# EAGLE design BluetoothB1 (EAGLE 7.7.0)
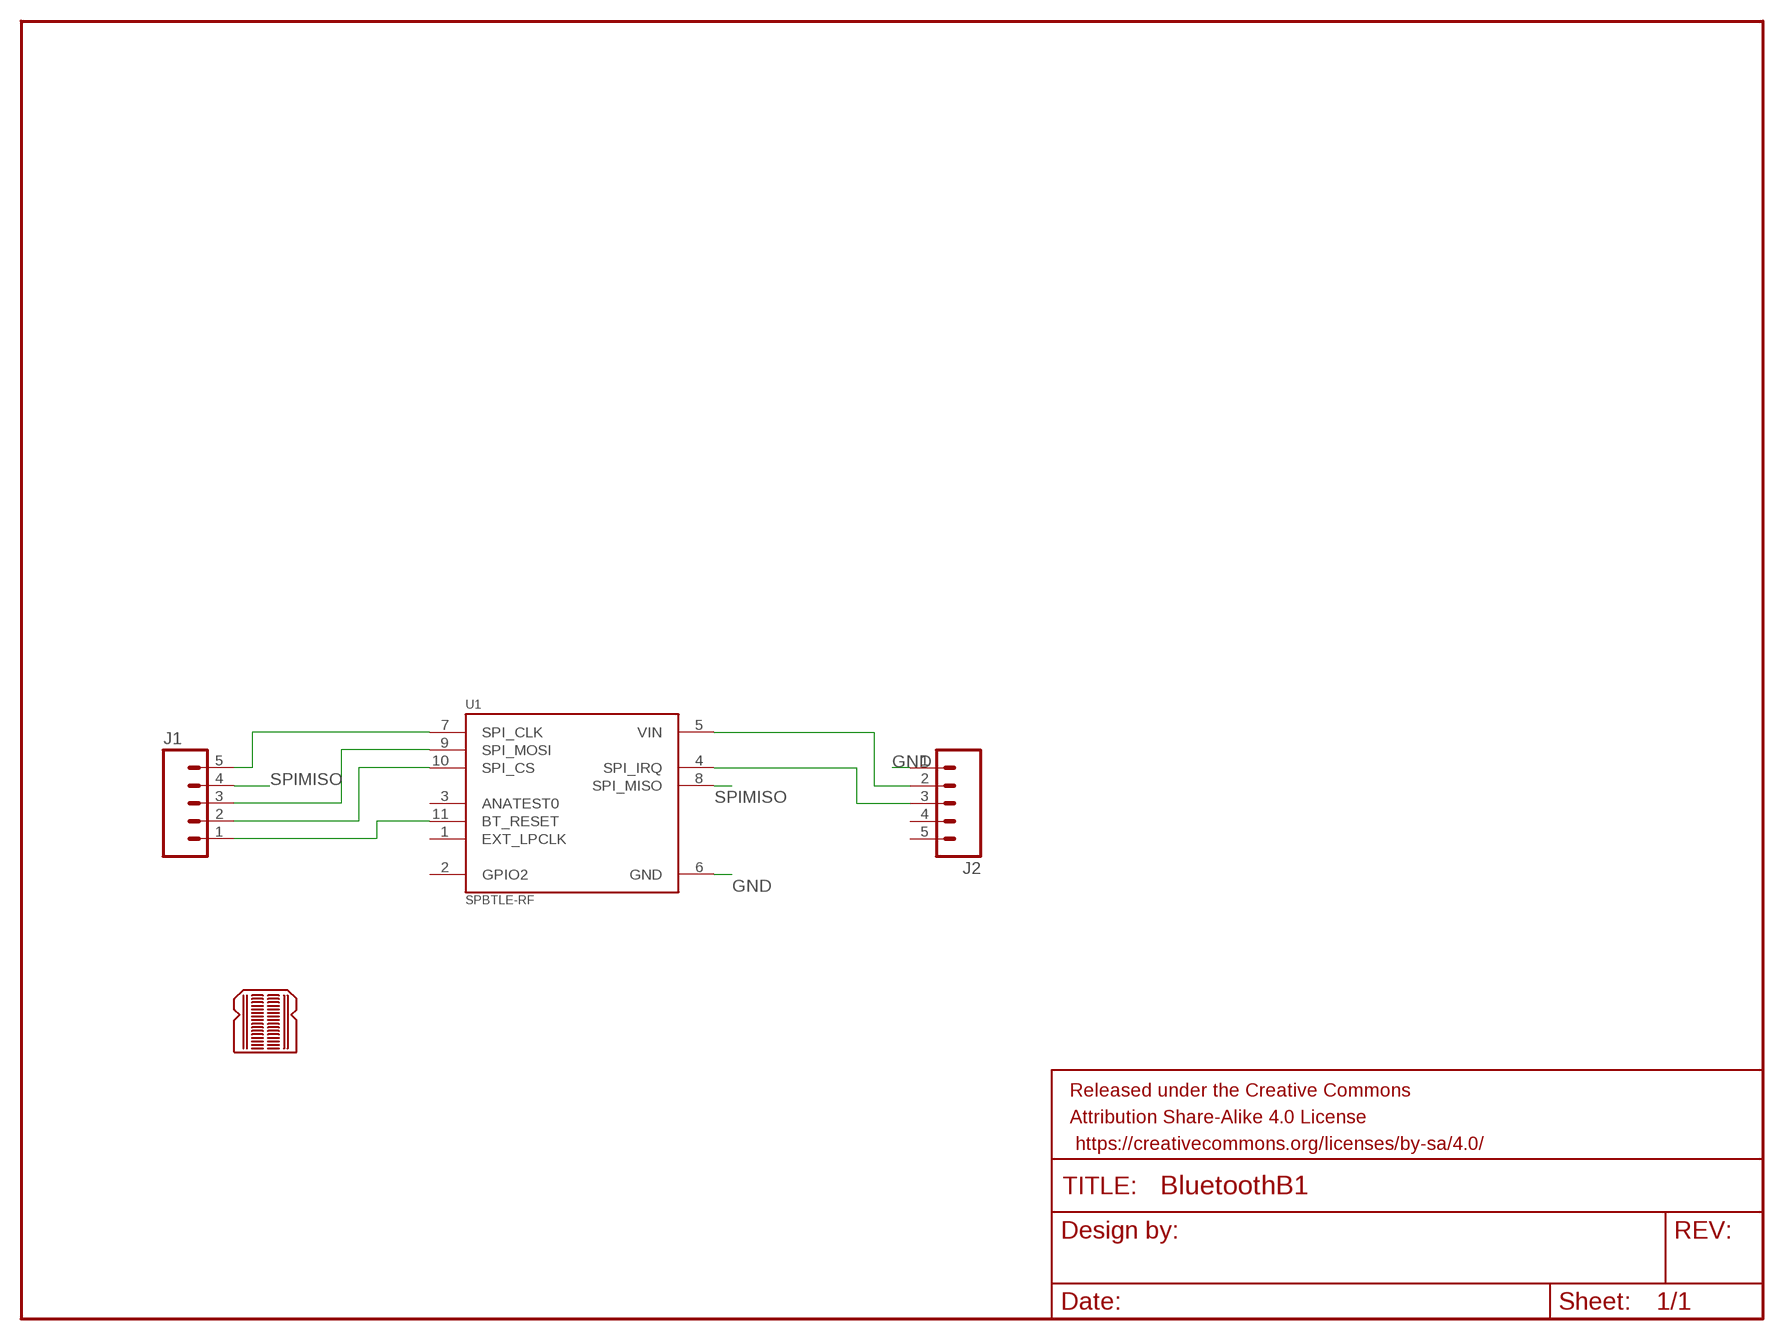
[diagram p0: schematic, sheet 1]

## Parts
FRAME1  FRAME-LETTER  [CREATIVE_COMMONS]
J1  M05PTH  [1X05]
J2  M05PTH  [1X05]
LOGO1  BREADBOARD_PATTERN  [BREADBOARD_SPACING]
U1  SPBTLE-RF  [XCVR_SPBTLE-RF]

## Nets
GND: J2.1 U1.6(GND)
N$1: J1.5 U1.7(SPI_CLK)
N$2: J1.3 U1.9(SPI_MOSI)
N$3: J1.2 U1.10(SPI_CS)
N$4: J1.1 U1.11(BT_RESET)
N$5: J2.2 U1.5(VIN)
N$6: J2.3 U1.4(SPI_IRQ)
SPIMISO: J1.4 U1.8(SPI_MISO)
Unconnected: J2.4 J2.5 U1.1(EXT_LPCLK) U1.2(GPIO2) U1.3(ANATEST0)

## Library data of the parts
FRAME1 = SparkFun-Aesthetics:FRAME-LETTER: Schematic Frame Standard 8.5x11 US Letter frame
J1 J2 = SparkFun-Connectors:M05: Header 5 Standard 5-pin 0.1" header. Use with straight break away headers (SKU : PRT-00116), right angle break away headers (PRT-00553), swiss pins (PRT-00743), machine pins (PRT-00117), and female headers (PRT-00115). Molex polarized connector foot print use with SKU : PRT-08230 with associated crimp pins and housings.
LOGO1 = SparkFun-Aesthetics:BREADBOARD_PATTERN: Reference markings that correspond to solderless breadboard row spacing.
U1 = SPBTLE-RF:SPBTLE-RF: Very low power module for Bluetooth Smart v4.1; AVAILABILITY: Good; DESCRIPTION: Very low power module for Bluetooth Smart v4.1; MF: STMicroelectronics; MP: SPBTLE-RF; PACKAGE: None; PRICE: 8.48 USD

## Board
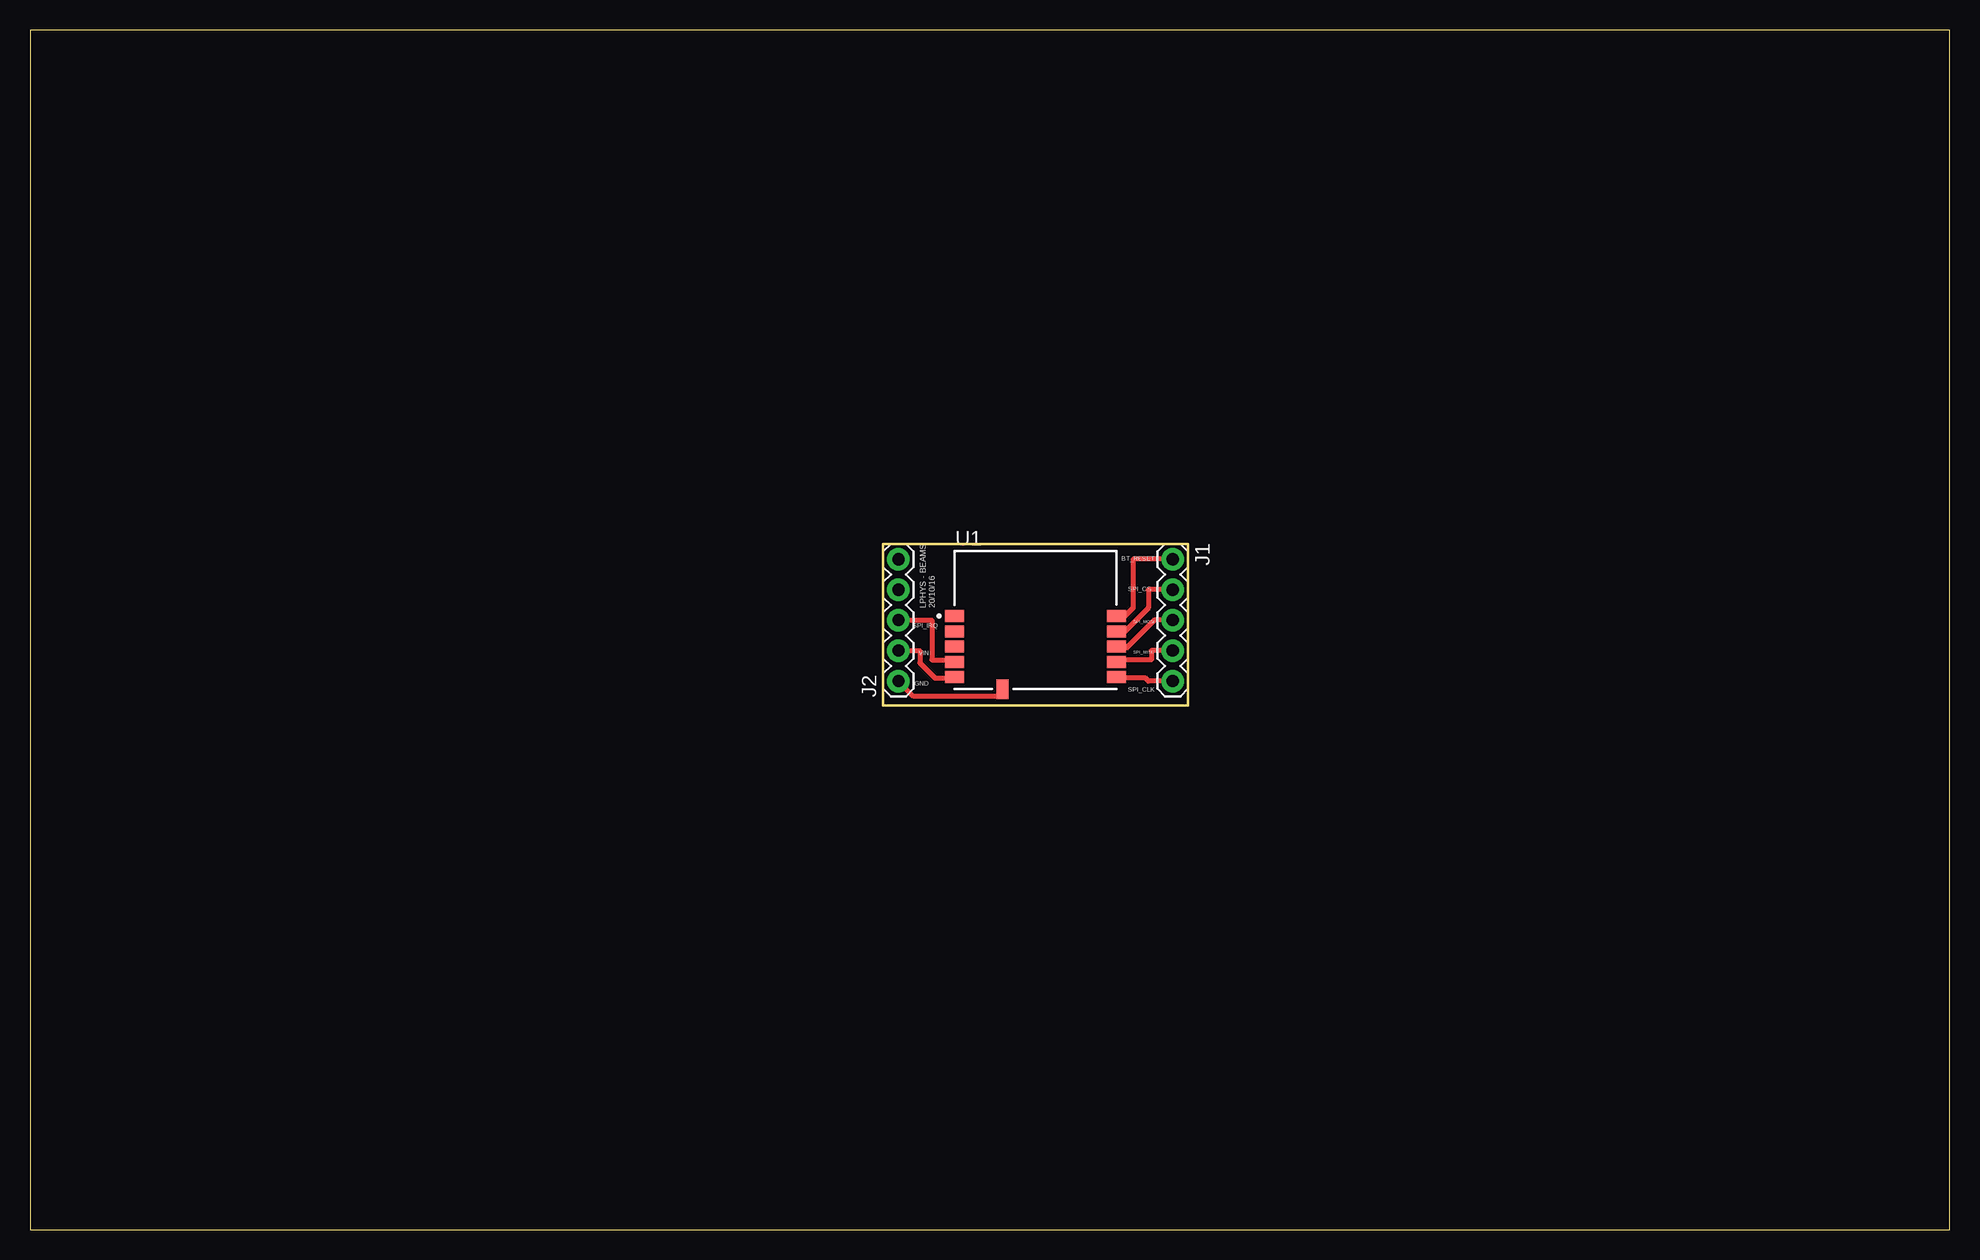
[diagram p1: board, top side]

Size 160 x 100 mm. Coordinates in mm from the lower left corner, seen from the top.
Outline: 0,0 160,0 160,100 0,100 0,0
Outline: 71.12,57.15 71.12,43.69 96.52,43.69 96.52,57.15 71.12,57.15
Copper layers (1*16): Top 0.035mm / dielectric 1.5mm / Bottom 0.035mm
Design rules "SparkFun *": minimum track width 8mil, minimum drill 20mil, track to track 4mil, track to pad 4mil, pad to pad 4mil, via to via 4mil, smd to smd 4mil, copper to edge 8mil, drill to drill 8mil, minimum pad ring 12mil, minimum via ring 10mil, stop-mask expansion 4mil, vias tented up to drill 20mil, thermal gap 10mil

### Footprints (pad centres in the part's own frame; a part is rotated, then mirrored left to right if it is on the bottom)
1X05 = drill 1.016 pad 1.88: 1 0,0; 2 2.54,0; 3 5.08,0; 4 7.62,0; 5 10.16,0
XCVR_SPBTLE-RF = smd 1.6 x 1: 1 -6.75,0.33; 2 -6.75,-0.94; 3 -6.75,-2.21; 4 -6.75,-3.48; 5 -6.75,-4.75; 7 6.75,-4.75; 8 6.75,-3.48; 9 6.75,-2.21; 10 6.75,-0.94; 11 6.75,0.33 | smd 1 x 1.6: 6 -2.75,-5.75

### Placement (x,y rotation side)
J1  95.25,55.88 270 top
J2  72.39,45.72 90 top
U1  83.82,50.8 0 top

### Tracks (layer width: path | path; a pad name or v marks a point on that pad's centre or on a via)
GND
  Top 0.406: 81.28,44.45 73.66,44.45 J2.1
  Top 0.457: 81.28,44.45 81.28,44.84 U1.6
N$1
  Top 0.406: J1.5 93.22,45.72 92.96,45.97 90.65,45.97 U1.7
N$2
  Top 0.406: U1.9 90.65,48.51 91.44,48.51 93.73,50.8 J1.3
N$3
  Top 0.406: J1.2 93.22,53.34 93.22,51.82 91.19,49.78 90.65,49.78 U1.10
N$4
  Top 0.406: J1.1 91.95,55.88 91.95,51.82 91.19,51.05 90.65,51.05 U1.11
N$5
  Top 0.406: J2.2 74.17,48.26 74.17,47.24 75.44,45.97 76.99,45.97 U1.5
N$6
  Top 0.406: J2.3 75.18,50.8 75.18,47.5 76.89,47.5 U1.4
SPIMISO
  Top 0.406: 90.65,47.24 U1.8 90.75,47.5 93.47,47.5 93.47,48.26 J1.4

### Text on the board
tPlace: BT_RESET | SPI_CS | LPHYS - BEAMS / 20/10/16 | SPI_IRQ | SPI_MOSI | VIN | SPI_MISO | GND | SPI_CLK